# EAGLE design teensy_3-6sch (EAGLE 7.7.0)

## Sheet 1 of 3
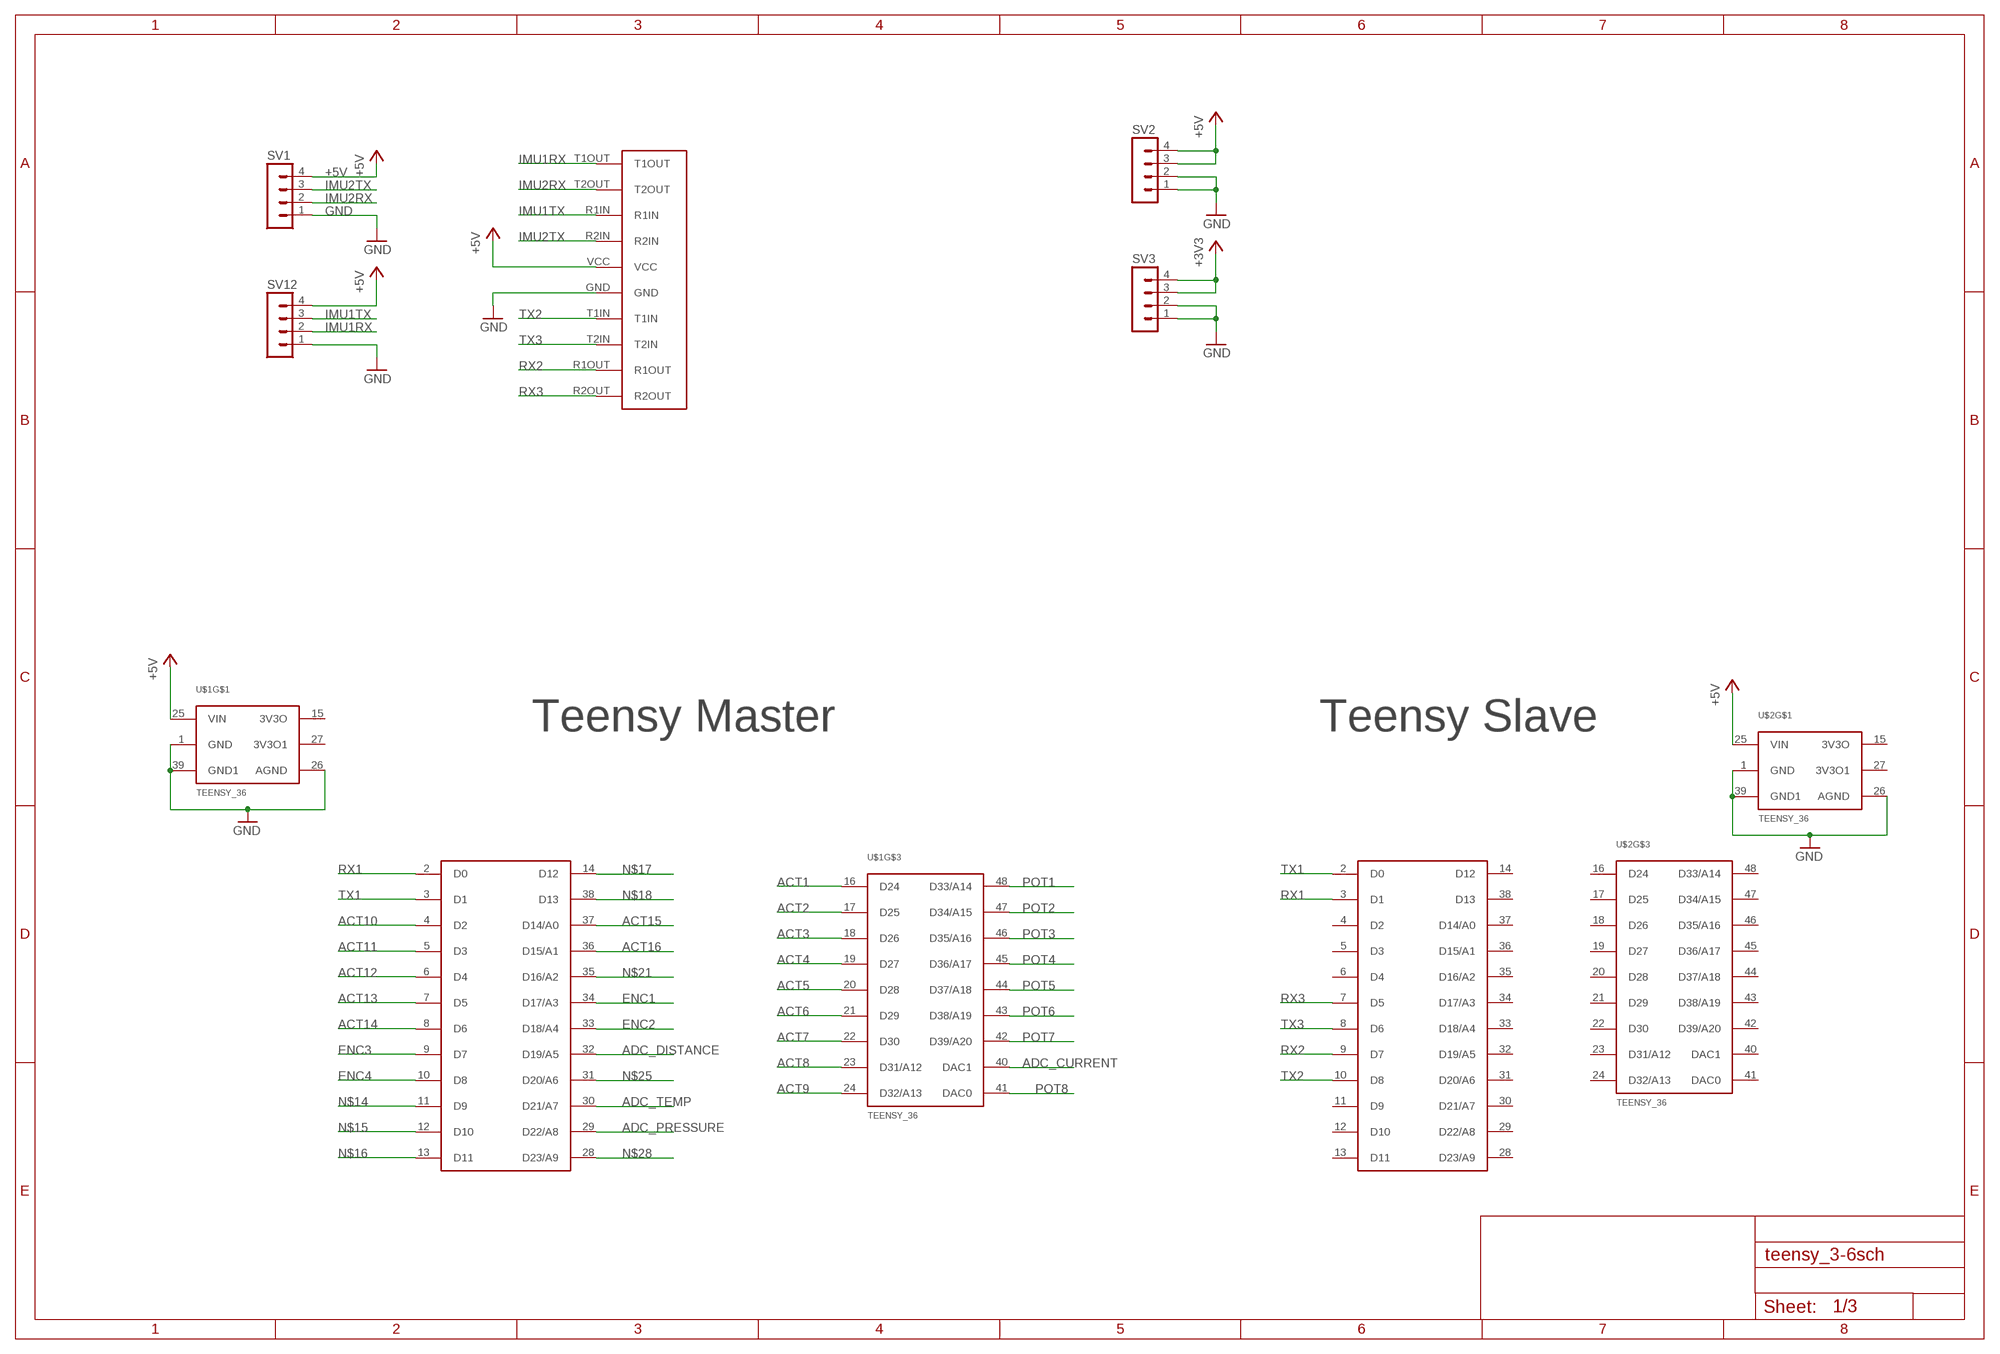
[diagram p0: schematic, sheet 1]

### Parts
SV1  MA04-1  [MA04-1]
SV2  MA04-1  [MA04-1]
SV3  MA04-1  [MA04-1]
SV12  MA04-1  [MA04-1]
U$1  TEENSY_36  [TEENSY36]
U$2  TEENSY_36  [TEENSY36]
U$3  MAX232_BREAKOUT  [MAX232_BREAKOUT]

### Nets
+3V3: SV3.3 SV3.4 ; also sheet 2,3
+5V: SV1.4 SV2.3 SV2.4 SV12.4 U$1.25(VIN) U$2.25(VIN) U$3.VCC ; also sheet 3
ACT1: U$1.16(D24) ; also sheet 2
ACT2: U$1.17(D25) ; also sheet 2
ACT3: U$1.18(D26) ; also sheet 2
ACT4: U$1.19(D27) ; also sheet 2
ACT5: U$1.20(D28) ; also sheet 2
ACT6: U$1.21(D29) ; also sheet 2
ACT7: U$1.22(D30) ; also sheet 2
ACT8: U$1.23(D31/A12) ; also sheet 2
ACT9: U$1.24(D32/A13) ; also sheet 2
ACT10: U$1.4(D2) ; also sheet 2
ACT11: U$1.5(D3) ; also sheet 2
ACT12: U$1.6(D4) ; also sheet 2
ACT13: U$1.7(D5) ; also sheet 2
ACT14: U$1.8(D6) ; also sheet 2
ACT15: U$1.37(D14/A0) ; also sheet 2
ACT16: U$1.36(D15/A1) ; also sheet 2
ADC_CURRENT: U$1.40(DAC1) ; also sheet 3
ADC_DISTANCE: U$1.32(D19/A5) ; also sheet 3
ADC_PRESSURE: U$1.29(D22/A8) ; also sheet 3
ADC_TEMP: U$1.30(D21/A7) ; also sheet 3
ENC1: U$1.34(D17/A3) ; also sheet 3
ENC2: U$1.33(D18/A4) ; also sheet 3
ENC3: U$1.9(D7) ; also sheet 3
ENC4: U$1.10(D8) ; also sheet 3
GND: SV1.1 SV2.1 SV2.2 SV3.1 SV3.2 SV12.1 U$1.1(GND) U$1.26(AGND) U$1.39(GND1) U$2.1(GND) U$2.26(AGND) U$2.39(GND1) U$3.GND ; also sheet 2,3
IMU1RX: SV12.2 U$3.T1OUT
IMU1TX: SV12.3 U$3.R1IN
IMU2RX: SV1.2 U$3.T2OUT
IMU2TX: SV1.3 U$3.R2IN
N$14: U$1.11(D9)
N$15: U$1.12(D10)
N$16: U$1.13(D11)
N$17: U$1.14(D12)
N$18: U$1.38(D13)
N$21: U$1.35(D16/A2)
N$25: U$1.31(D20/A6)
N$28: U$1.28(D23/A9)
POT1: U$1.48(D33/A14) ; also sheet 2
POT2: U$1.47(D34/A15) ; also sheet 2
POT3: U$1.46(D35/A16) ; also sheet 2
POT4: U$1.45(D36/A17) ; also sheet 2
POT5: U$1.44(D37/A18) ; also sheet 2
POT6: U$1.43(D38/A19) ; also sheet 2
POT7: U$1.42(D39/A20) ; also sheet 2
POT8: U$1.41(DAC0) ; also sheet 2
RX1: U$1.2(D0) U$2.3(D1)
RX2: U$2.9(D7) U$3.R1OUT
RX3: U$2.7(D5) U$3.R2OUT
TX1: U$1.3(D1) U$2.2(D0)
TX2: U$2.10(D8) U$3.T1IN
TX3: U$2.8(D6) U$3.T2IN
Unconnected: U$1.15(3V3O) U$1.27(3V3O1) U$2.4(D2) U$2.5(D3) U$2.6(D4) U$2.11(D9) U$2.12(D10) U$2.13(D11) U$2.14(D12) U$2.15(3V3O) U$2.16(D24) U$2.17(D25) U$2.18(D26) U$2.19(D27) U$2.20(D28) U$2.21(D29) U$2.22(D30) U$2.23(D31/A12) U$2.24(D32/A13) U$2.27(3V3O1) U$2.28(D23/A9) U$2.29(D22/A8) U$2.30(D21/A7) U$2.31(D20/A6) U$2.32(D19/A5) U$2.33(D18/A4) U$2.34(D17/A3) U$2.35(D16/A2) U$2.36(D15/A1) U$2.37(D14/A0) U$2.38(D13) U$2.40(DAC1) U$2.41(DAC0) U$2.42(D39/A20) U$2.43(D38/A19) U$2.44(D37/A18) U$2.45(D36/A17) U$2.46(D35/A16) U$2.47(D34/A15) U$2.48(D33/A14)

### Notes on the sheet
- Teensy Master | Teensy Slave

## Sheet 2 of 3
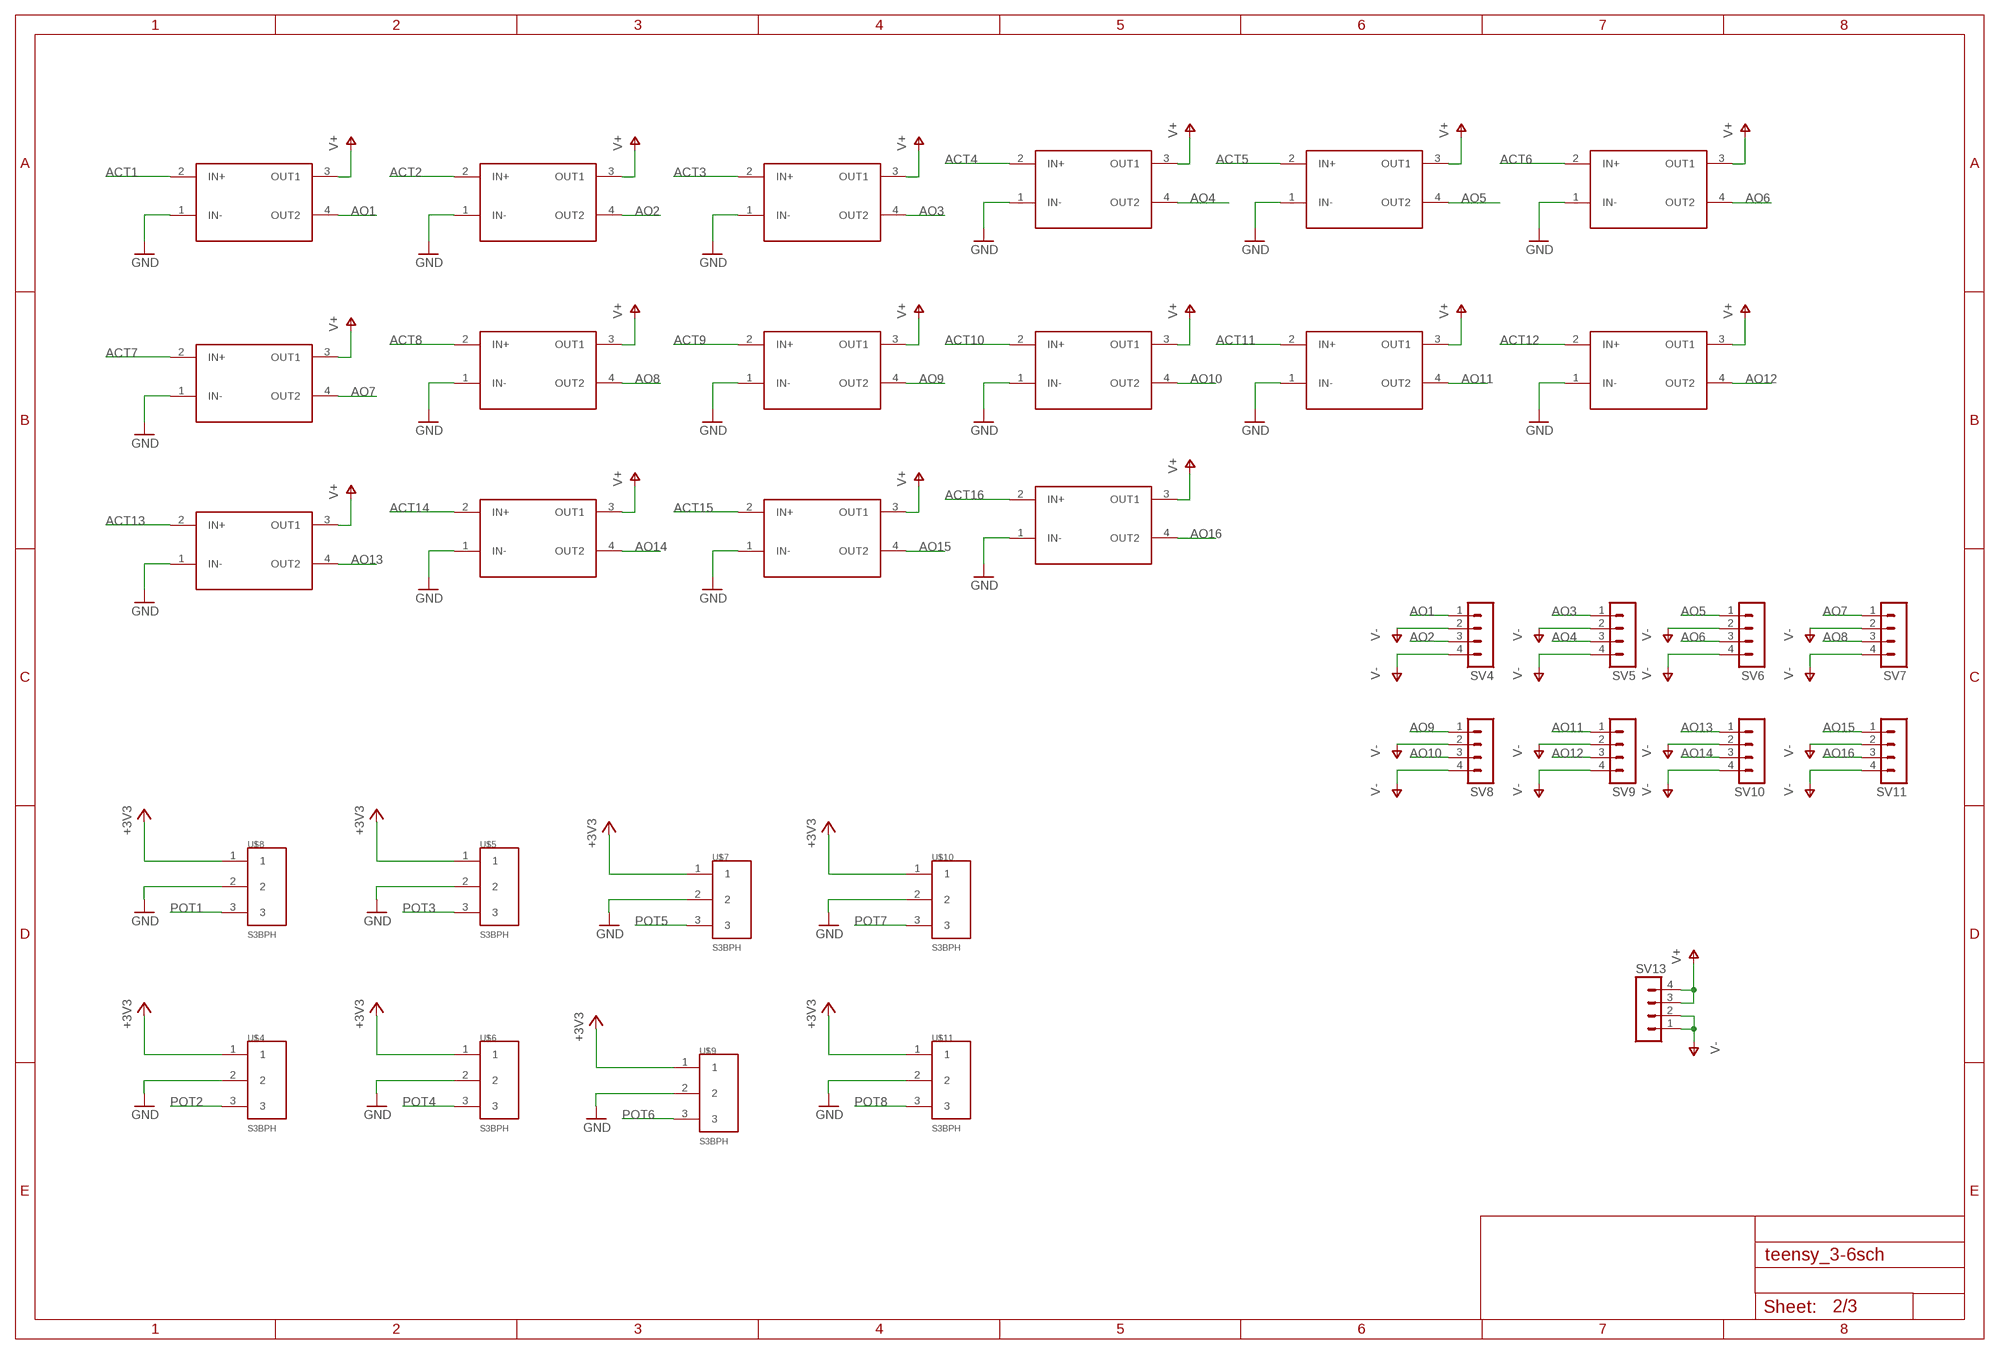
[diagram p1: schematic, sheet 2]

### Parts
SV4  MA04-1  [MA04-1]
SV5  MA04-1  [MA04-1]
SV6  MA04-1  [MA04-1]
SV7  MA04-1  [MA04-1]
SV8  MA04-1  [MA04-1]
SV9  MA04-1  [MA04-1]
SV10  MA04-1  [MA04-1]
SV11  MA04-1  [MA04-1]
SV13  MA04-1  [MA04-1]
U$4  S3BPH  [S3BPH]
U$5  S3BPH  [S3BPH]
U$6  S3BPH  [S3BPH]
U$7  S3BPH  [S3BPH]
U$8  S3BPH  [S3BPH]
U$9  S3BPH  [S3BPH]
U$10  S3BPH  [S3BPH]
U$11  S3BPH  [S3BPH]
U$12  CPC1706  [CPC1706]
U$13  CPC1706  [CPC1706]
U$14  CPC1706  [CPC1706]
U$15  CPC1706  [CPC1706]
U$16  CPC1706  [CPC1706]
U$17  CPC1706  [CPC1706]
U$18  CPC1706  [CPC1706]
U$19  CPC1706  [CPC1706]
U$20  CPC1706  [CPC1706]
U$21  CPC1706  [CPC1706]
U$22  CPC1706  [CPC1706]
U$23  CPC1706  [CPC1706]
U$24  CPC1706  [CPC1706]
U$25  CPC1706  [CPC1706]
U$26  CPC1706  [CPC1706]
U$27  CPC1706  [CPC1706]

### Nets
+3V3: U$4.1 U$5.1 U$6.1 U$7.1 U$8.1 U$9.1 U$10.1 U$11.1 ; also sheet 1,3
ACT1: U$12.2(IN+) ; also sheet 1
ACT2: U$13.2(IN+) ; also sheet 1
ACT3: U$14.2(IN+) ; also sheet 1
ACT4: U$15.2(IN+) ; also sheet 1
ACT5: U$16.2(IN+) ; also sheet 1
ACT6: U$17.2(IN+) ; also sheet 1
ACT7: U$18.2(IN+) ; also sheet 1
ACT8: U$19.2(IN+) ; also sheet 1
ACT9: U$20.2(IN+) ; also sheet 1
ACT10: U$21.2(IN+) ; also sheet 1
ACT11: U$22.2(IN+) ; also sheet 1
ACT12: U$23.2(IN+) ; also sheet 1
ACT13: U$24.2(IN+) ; also sheet 1
ACT14: U$25.2(IN+) ; also sheet 1
ACT15: U$26.2(IN+) ; also sheet 1
ACT16: U$27.2(IN+) ; also sheet 1
AO1: SV4.1 U$12.4(OUT2)
AO2: SV4.3 U$13.4(OUT2)
AO3: SV5.1 U$14.4(OUT2)
AO4: SV5.3 U$15.4(OUT2)
AO5: SV6.1 U$16.4(OUT2)
AO6: SV6.3 U$17.4(OUT2)
AO7: SV7.1 U$18.4(OUT2)
AO8: SV7.3 U$19.4(OUT2)
AO9: SV8.1 U$20.4(OUT2)
AO10: SV8.3 U$21.4(OUT2)
AO11: SV9.1 U$22.4(OUT2)
AO12: SV9.3 U$23.4(OUT2)
AO13: SV10.1 U$24.4(OUT2)
AO14: SV10.3 U$25.4(OUT2)
AO15: SV11.1 U$26.4(OUT2)
AO16: SV11.3 U$27.4(OUT2)
GND: U$4.2 U$5.2 U$6.2 U$7.2 U$8.2 U$9.2 U$10.2 U$11.2 U$12.1(IN-) U$13.1(IN-) U$14.1(IN-) U$15.1(IN-) U$16.1(IN-) U$17.1(IN-) U$18.1(IN-) U$19.1(IN-) U$20.1(IN-) U$21.1(IN-) U$22.1(IN-) U$23.1(IN-) U$24.1(IN-) U$25.1(IN-) U$26.1(IN-) U$27.1(IN-) ; also sheet 1,3
POT1: U$8.3 ; also sheet 1
POT2: U$4.3 ; also sheet 1
POT3: U$5.3 ; also sheet 1
POT4: U$6.3 ; also sheet 1
POT5: U$7.3 ; also sheet 1
POT6: U$9.3 ; also sheet 1
POT7: U$10.3 ; also sheet 1
POT8: U$11.3 ; also sheet 1
V+: SV13.3 SV13.4 U$12.3(OUT1) U$13.3(OUT1) U$14.3(OUT1) U$15.3(OUT1) U$16.3(OUT1) U$17.3(OUT1) U$18.3(OUT1) U$19.3(OUT1) U$20.3(OUT1) U$21.3(OUT1) U$22.3(OUT1) U$23.3(OUT1) U$24.3(OUT1) U$25.3(OUT1) U$26.3(OUT1) U$27.3(OUT1)
V-: SV4.2 SV4.4 SV5.2 SV5.4 SV6.2 SV6.4 SV7.2 SV7.4 SV8.2 SV8.4 SV9.2 SV9.4 SV10.2 SV10.4 SV11.2 SV11.4 SV13.1 SV13.2

## Sheet 3 of 3
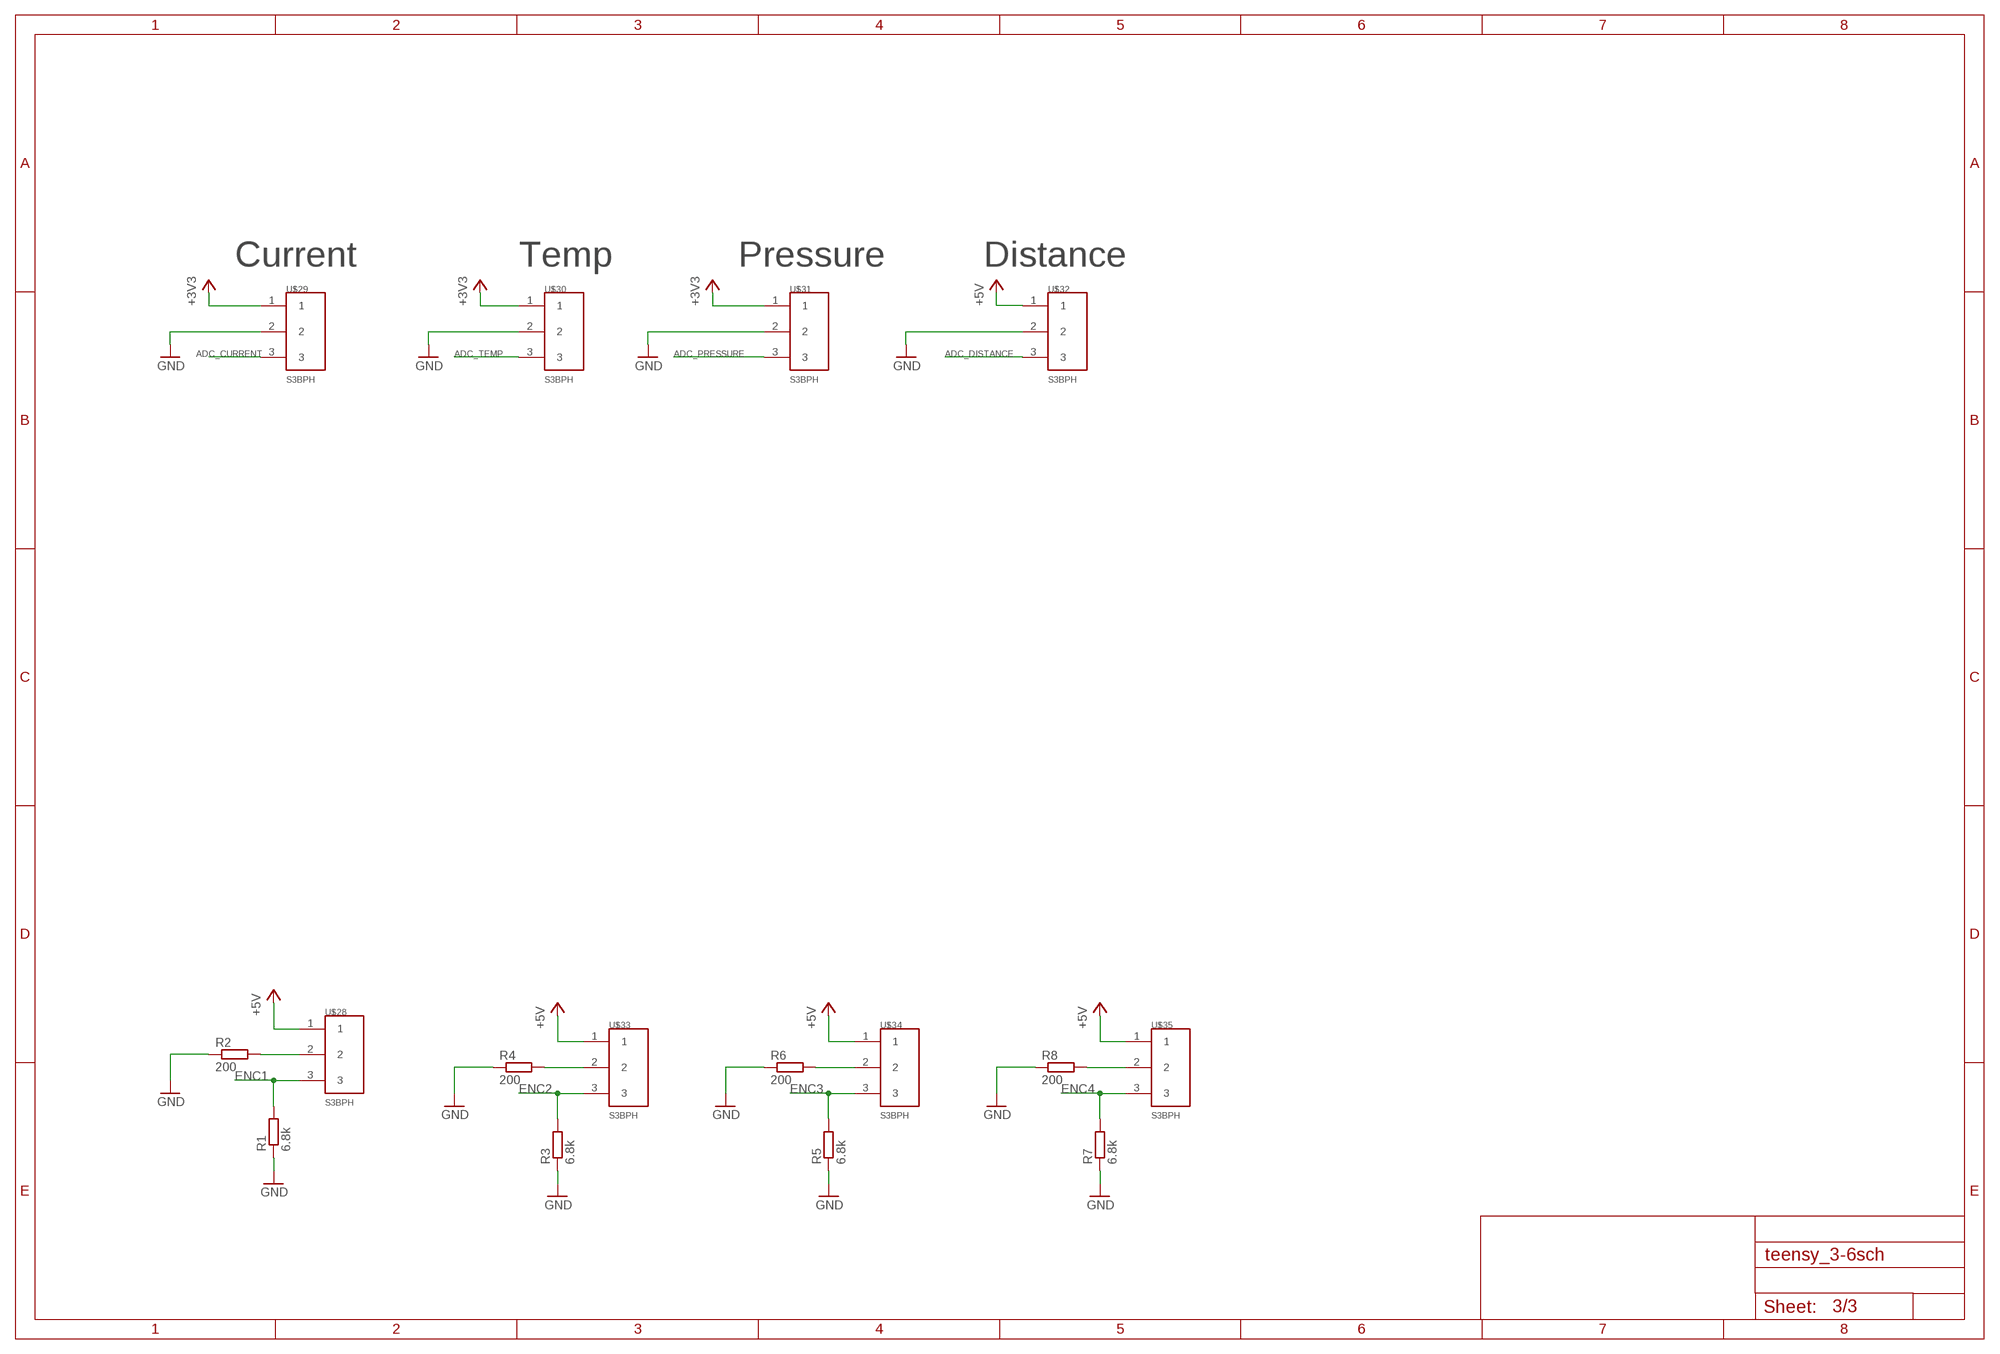
[diagram p2: schematic, sheet 3]

### Parts
R1  6.8k  R-EU_M0805  [M0805]
R2  200  R-EU_M0805  [M0805]
R3  6.8k  R-EU_M0805  [M0805]
R4  200  R-EU_M0805  [M0805]
R5  6.8k  R-EU_M0805  [M0805]
R6  200  R-EU_M0805  [M0805]
R7  6.8k  R-EU_M0805  [M0805]
R8  200  R-EU_M0805  [M0805]
U$28  S3BPH  [S3BPH]
U$29  S3BPH  [S3BPH]
U$30  S3BPH  [S3BPH]
U$31  S3BPH  [S3BPH]
U$32  S3BPH  [S3BPH]
U$33  S3BPH  [S3BPH]
U$34  S3BPH  [S3BPH]
U$35  S3BPH  [S3BPH]

### Nets
+3V3: U$29.1 U$30.1 U$31.1 ; also sheet 1,2
+5V: U$28.1 U$32.1 U$33.1 U$34.1 U$35.1 ; also sheet 1
ADC_CURRENT: U$29.3 ; also sheet 1
ADC_DISTANCE: U$32.3 ; also sheet 1
ADC_PRESSURE: U$31.3 ; also sheet 1
ADC_TEMP: U$30.3 ; also sheet 1
ENC1: R1.2 U$28.3 ; also sheet 1
ENC2: R3.2 U$33.3 ; also sheet 1
ENC3: R5.2 U$34.3 ; also sheet 1
ENC4: R7.2 U$35.3 ; also sheet 1
GND: R1.1 R2.1 R3.1 R4.1 R5.1 R6.1 R7.1 R8.1 U$29.2 U$30.2 U$31.2 U$32.2 ; also sheet 1,2
N$1: R2.2 U$28.2
N$2: R4.2 U$33.2
N$3: R6.2 U$34.2
N$4: R8.2 U$35.2

### Notes on the sheet
- Current | Temp | Pressure | Distance

## Library data of the parts
R1-R8 = rcl:R-EU_: RESISTOR, European symbol
SV1-SV13 = con-lstb:MA04-1: PIN HEADER; OC_FARNELL: unknown; OC_NEWARK: unknown
U$1 U$2 = misc_luke:TEENSY_36
U$3 = misc_luke:MAX232_BREAKOUT
U$4-U$11 U$28-U$35 = misc_luke:S3BPH
U$12-U$27 = misc_luke:CPC1706

## Board
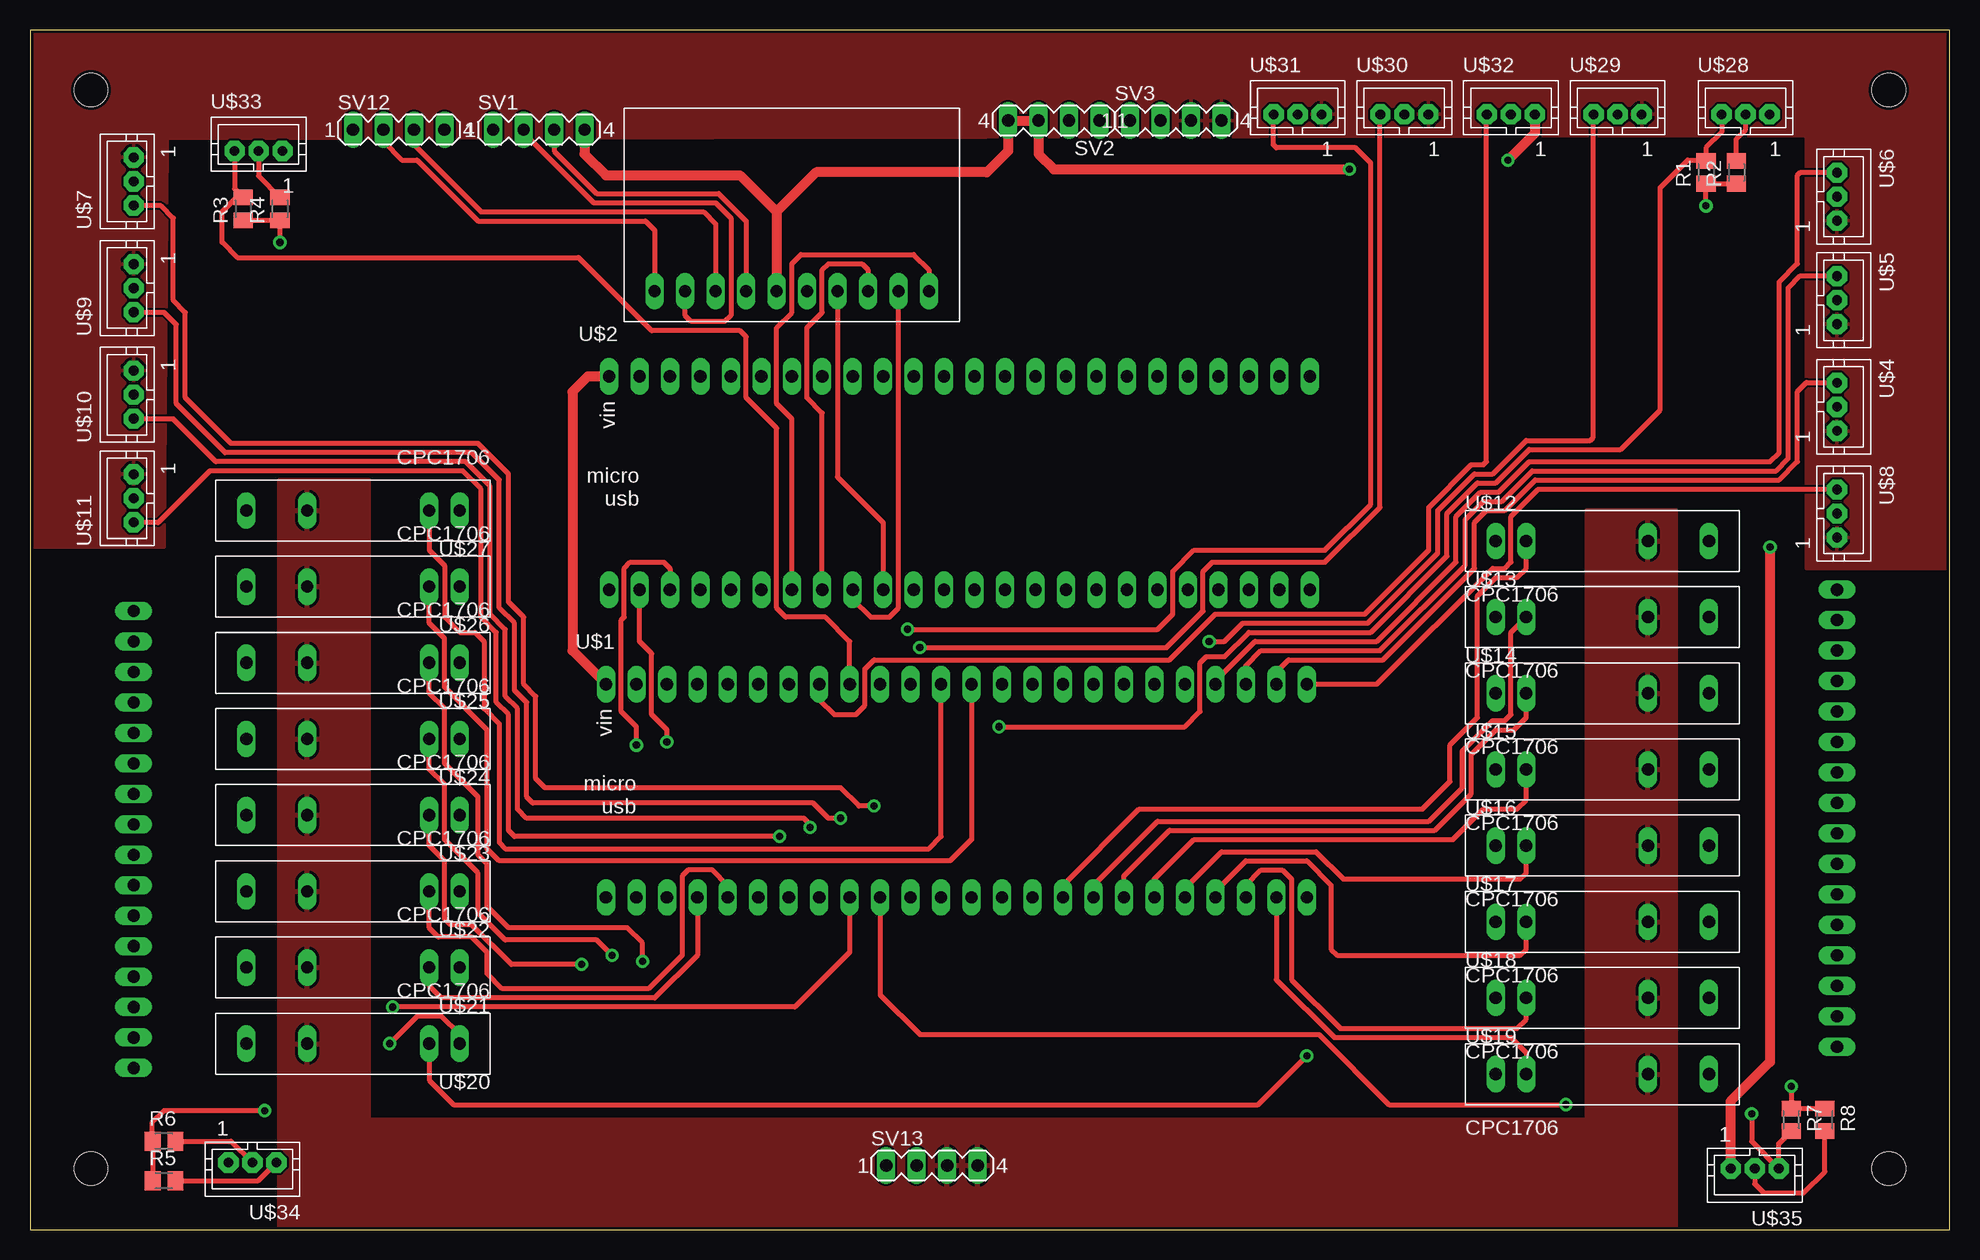
[diagram p3: board, top side]
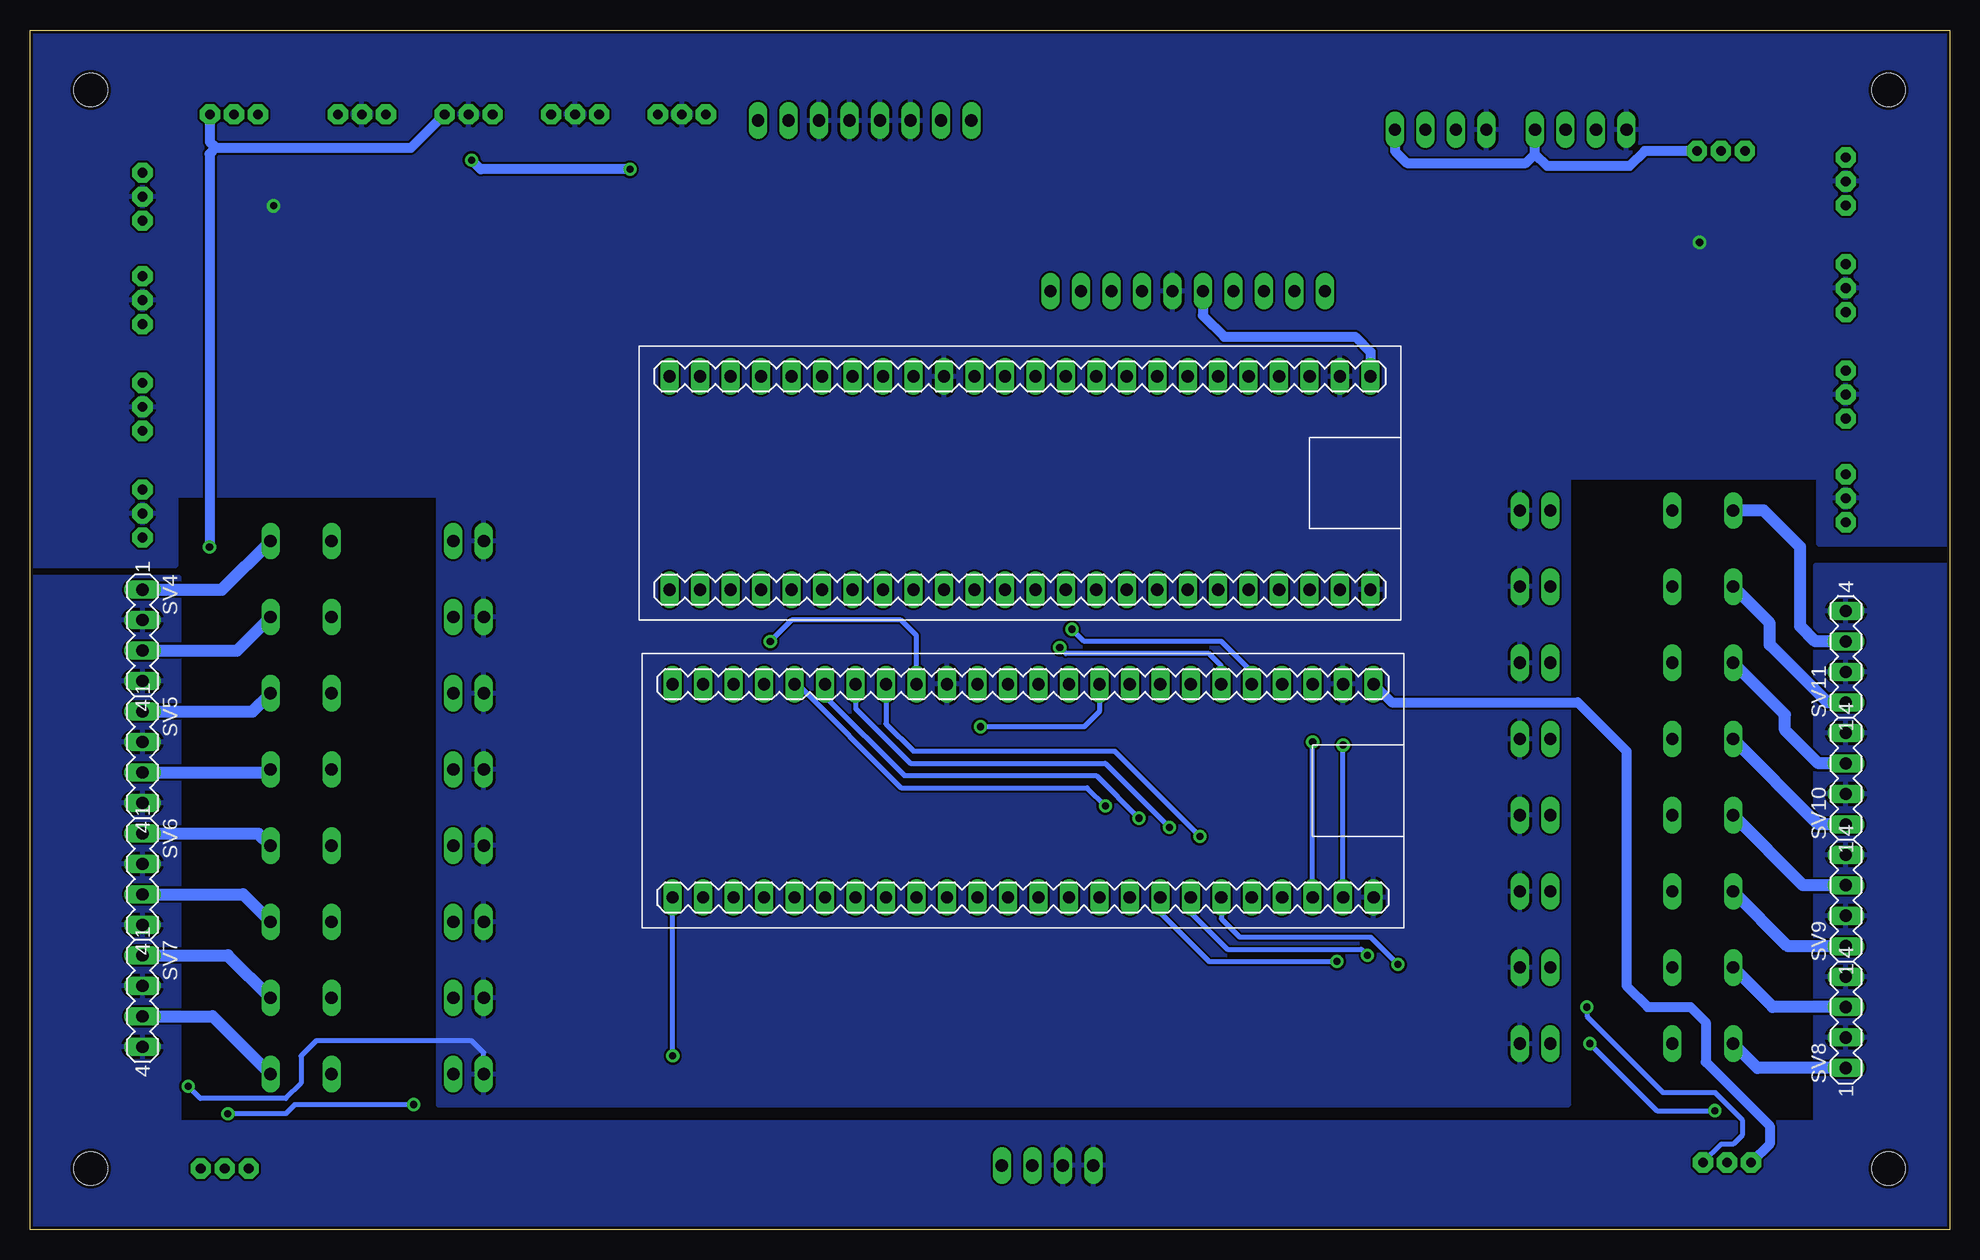
[diagram p4: board, bottom side, seen from below]

Size 160 x 100 mm. Coordinates in mm from the lower left corner, seen from the top.
Outline: 0,0 160,0 160,100 0,100 0,0
Copper layers (1*16): Top 0.035mm / dielectric 1.5mm / Bottom 0.035mm
Design rules "GoldPhoenix": minimum track width 7mil, minimum drill 10mil, track to track 7mil, track to pad 7mil, pad to pad 7mil, via to via 7mil, smd to smd 7mil, copper to edge 10mil, drill to drill 8mil, minimum pad ring 10mil, minimum via ring 10mil, stop-mask expansion 4mil, vias tented up to drill 25mil, thermal gap 10mil
Holes 2.8 mm at 5.08,5.08 5.08,95 154.94,95 154.94,5.08

### Footprints (pad centres in the part's own frame; a part is rotated, then mirrored left to right if it is on the bottom)
M0805 = smd 1.3 x 1.6: 1 -0.95,0; 2 0.95,0
MA04-1 = drill 1.016 long: 1 -3.81,0; 2 -1.27,0; 3 1.27,0; 4 3.81,0
TEENSY36 = drill 1.016 long: 1 -25.4,-8.89; 2 -22.86,-8.89; 3 -20.32,-8.89; 4 -17.78,-8.89; 5 -15.24,-8.89; 6 -12.7,-8.89; 7 -10.16,-8.89; 8 -7.62,-8.89; 9 -5.08,-8.89; 10 -2.54,-8.89; 11 0,-8.89; 12 2.54,-8.89; 13 5.08,-8.89; 14 7.62,-8.89; 15 10.16,-8.89; 16 12.7,-8.89; 17 15.24,-8.89; 18 17.78,-8.89; 19 20.32,-8.89; 20 22.86,-8.89; 21 25.4,-8.89; 22 27.94,-8.89; 23 30.48,-8.89; 24 33.02,-8.89; 25 -25.4,8.89; 26 -22.86,8.89; 27 -20.32,8.89; 28 -17.78,8.89; 29 -15.24,8.89; 30 -12.7,8.89; 31 -10.16,8.89; 32 -7.62,8.89; 33 -5.08,8.89; 34 -2.54,8.89; 35 0,8.89; 36 2.54,8.89; 37 5.08,8.89; 38 7.62,8.89; 39 10.16,8.89; 40 12.7,8.89; 41 15.24,8.89; 42 17.78,8.89; 43 20.32,8.89; 44 22.86,8.89; 45 25.4,8.89; 46 27.94,8.89; 47 30.48,8.89; 48 33.02,8.89
MAX232_BREAKOUT = drill 1.016 long: GND 12.7,0; R1IN 5.08,0; R1OUT 20.32,0; R2IN 7.62,0; R2OUT 22.86,0; T1IN 15.24,0; T1OUT 0,0; T2IN 17.78,0; T2OUT 2.54,0; VCC 10.16,0
S3BPH = drill 0.813 pad 1.676 octagon: 1 2,0; 2 0,0; 3 -2,0
CPC1706 = drill 1.016 long: 1 -7.62,0; 2 -5.08,0; 3 5.08,0; 4 10.16,0

### Placement (x,y rotation side)
R1  139.7,88.14 90 top
R2  142.24,88.14 90 top
R3  17.78,85.09 90 top
R4  20.83,85.09 90 top
R5  11.18,4.06 0 top
R6  11.18,7.37 0 top
R7  146.81,9.14 270 top
R8  149.61,9.14 270 top
SV1  42.42,91.69 0 top
SV2  85.34,92.46 180 top
SV3  95.5,92.46 0 top
SV4  150.62,49.53 270 bottom
SV5  150.62,39.37 270 bottom
SV6  150.62,29.21 270 bottom
SV7  150.62,19.05 270 bottom
SV8  8.64,17.27 90 bottom
SV9  8.64,27.43 90 bottom
SV10  8.64,37.59 90 bottom
SV11  8.64,47.75 90 bottom
SV12  30.73,91.69 0 top
SV13  75.18,5.33 0 top
U$1  73.41,36.58 0 top
U$2  73.66,62.23 0 top
U$3  52.07,78.23 0 top
U$4  150.62,68.58 270 top
U$5  150.62,77.47 270 top
U$6  150.62,86.11 270 top
U$7  8.64,87.38 90 top
U$8  150.62,59.69 270 top
U$9  8.64,78.49 90 top
U$10  8.64,69.6 90 top
U$11  8.64,60.96 90 top
U$12  129.79,57.4 0 top
U$13  129.79,51.05 0 top
U$14  129.79,44.7 0 top
U$15  129.79,38.35 0 top
U$16  129.79,32 0 top
U$17  129.79,25.65 0 top
U$18  129.79,19.3 0 top
U$19  129.79,12.95 0 top
U$20  28.19,15.49 180 top
U$21  28.19,21.84 180 top
U$22  28.19,28.19 180 top
U$23  28.19,34.54 180 top
U$24  28.19,40.89 180 top
U$25  28.19,47.24 180 top
U$26  28.19,53.59 180 top
U$27  28.19,59.94 180 top
U$28  143,92.96 0 top
U$29  132.33,92.96 0 top
U$30  114.55,92.96 0 top
U$31  105.66,92.96 0 top
U$32  123.44,92.96 0 top
U$33  19.05,89.92 0 top
U$34  18.54,5.59 180 top
U$35  143.76,5.08 180 top

### Tracks (layer width: path | path; a pad name or v marks a point on that pad's centre or on a via)
+3V3
  pour Top (rank 2): 0,100.08 160.02,100.08 160.02,55.12 148.08,55.12 148.08,91.19 11.43,90.93 11.18,56.9 0,56.9
+5V  (via drill 0.6)
  Top 0.813: v109.98,88.39 85.34,88.39 84.07,89.66 SV2.3 SV2.4 81.53,89.92 79.76,88.14 65.53,88.14 62.23,84.84 | v123.19,89.15 125.48,91.44 125.48,92.93 U$32.1 | v145.03,56.9 145.03,13.97 141.73,10.67 141.73,5.11 U$35.1 | 62.23,84.84 U$3.VCC | SV1.4 46.23,89.66 48.01,87.88 59.18,87.88 62.23,84.84 | U$2.25 46.48,71.12 45.21,69.85 45.21,48.26 U$1.25
  Bottom 0.813: U$28.1 145,90.65 144.53,90.17 | 144.53,90.17 128.24,90.17 U$32.1 | v109.98,88.39 122.43,88.39 v123.19,89.15 | 144.53,90.17 145.03,89.66 v145.03,56.9 | U$1.25 46.48,43.94 30.99,43.94 26.92,39.88 26.92,20.32 25.15,18.54 21.59,18.54 20.32,17.27 20.32,13.97 14.99,8.64 14.99,7.11 16.51,5.59 U$34.1 | SV1.4 46.23,89.92 45.21,88.9 35.31,88.9 34.54,89.66 | 34.54,89.66 SV12.4 | U$33.1 25.4,89.92 26.67,88.65 33.53,88.65 34.54,89.66 | U$3.VCC 62.23,76.2 60.45,74.42 49.53,74.42 48.26,73.15 U$2.25
ACT1
  Top 0.406: U$1.16 86.11,28.7 92.46,35.05 116.08,35.05 118.36,37.34 118.36,40.39 120.65,42.67 120.65,52.83 122.17,54.36 123.95,54.36 124.71,55.12 U$12.2
ACT2
  Top 0.406: U$1.17 88.65,28.7 93.98,34.04 116.59,34.04 119.38,36.83 119.38,39.88 121.92,42.42 122.94,42.42 123.44,42.93 123.44,49.78 U$13.2
ACT3
  Top 0.406: U$1.18 91.19,29.46 95,33.27 117.09,33.27 120.14,36.32 120.14,39.62 122.17,41.66 123.7,41.66 124.71,42.67 U$14.2
ACT4
  Top 0.406: U$1.19 93.73,29.21 97.03,32.51 118.62,32.51 121.16,35.05 123.95,35.05 124.71,35.81 U$15.2
ACT5
  Top 0.406: U$1.20 96.27,28.45 99.31,31.5 107.19,31.5 109.47,29.21 124.21,29.21 124.71,29.72 U$16.2
ACT6
  Top 0.406: U$1.21 98.81,28.19 101.35,30.73 106.43,30.73 108.46,28.7 108.46,23.37 108.97,22.86 124.21,22.86 124.71,23.37 U$17.2
ACT7
  Top 0.406: U$1.22 101.35,28.7 102.62,29.97 104.39,29.97 105.16,29.21 105.16,20.83 109.22,16.76 123.95,16.76 124.71,17.53 U$18.2
ACT8
  Top 0.406: U$1.23 103.89,20.83 108.71,16 123.44,16 124.71,14.73 U$19.2
ACT9  (via drill 0.6)
  Top 0.406: U$20.2 33.27,12.45 35.31,10.41 102.36,10.41 v106.43,14.48
  Bottom 0.406: v106.43,14.48 U$1.24
ACT10
  Top 0.406: U$1.4 55.63,22.86 52.07,19.3 34.29,19.3 33.27,20.32 U$21.2
ACT11
  Top 0.406: U$1.5 58.17,28.7 56.9,29.97 54.86,29.97 54.36,29.46 54.36,22.86 51.56,20.07 39.37,20.07 38.1,21.34 38.1,23.11 36.83,24.38 34.04,24.38 33.27,25.15 U$22.2
ACT12  (via drill 0.6)
  Top 0.406: v45.97,22.1 40.13,22.1 36.83,25.4 35.05,25.4 34.54,25.91 34.54,30.73 33.27,32 U$23.2
  Bottom 0.406: U$1.6 60.71,25.91 59.18,24.38 48.26,24.38 v45.97,22.1
ACT13  (via drill 0.6)
  Top 0.406: v48.51,22.86 47.24,24.13 39.62,24.13 37.34,26.42 37.34,29.72 34.54,32.51 34.54,37.08 33.27,38.35 U$24.2
  Bottom 0.406: U$1.7 63.25,26.42 60.2,23.37 49.02,23.37 v48.51,22.86
ACT14  (via drill 0.6)
  Top 0.406: v51.05,22.35 51.05,23.88 49.78,25.15 39.88,25.15 38.1,26.92 38.1,30.48 37.34,31.24 37.34,36.07 34.54,38.86 34.54,43.43 33.27,44.7 U$25.2
  Bottom 0.406: U$1.8 65.79,26.42 61.72,22.35 v51.05,22.35
ACT15
  Top 0.406: U$1.37 78.49,32.51 76.71,30.73 39.12,30.73 38.1,31.75 38.1,41.66 34.54,45.21 34.54,49.28 33.27,50.55 U$26.2
ACT16
  Top 0.406: U$27.2 33.27,56.64 34.54,55.37 34.54,51.05 35.81,49.78 37.08,49.78 37.85,49.02 37.85,43.43 39.12,42.16 39.12,32.26 39.62,31.75 74.93,31.75 75.95,32.77 U$1.36
ADC_CURRENT  (via drill 0.6)
  Top 0.406: v98.3,49.02 99.57,49.02 101.09,50.55 111.51,50.55 117.35,56.39 117.35,59.94 120.4,62.99 121.92,62.99 124.71,65.79 130.05,65.79 130.3,66.04 130.3,92.93 U$29.3
  Bottom 0.406: U$1.40 86.11,49.53 87.38,50.8 96.52,50.8 v98.3,49.02
ADC_DISTANCE
  Top 0.406: U$1.32 65.79,44.2 67.06,42.93 68.83,42.93 69.6,43.69 69.6,46.74 70.36,47.5 95,47.5 98.81,51.31 111.25,51.31 116.59,56.64 116.59,60.2 120.14,63.75 121.16,63.75 121.41,64.01 121.41,92.93 U$32.3
ADC_PRESSURE  (via drill 0.6)
  Top 0.406: v73.15,50.04 93.98,50.04 95.25,51.31 95.25,54.86 97.03,56.64 107.95,56.64 111.76,60.45 111.76,88.9 110.49,90.17 103.89,90.17 103.63,90.42 103.63,92.93 U$31.3
  Bottom 0.406: U$1.29 58.17,46.48 60.71,49.02 72.14,49.02 v73.15,50.04
ADC_TEMP  (via drill 0.6)
  Top 0.406: v74.17,48.51 94.74,48.51 97.79,51.56 97.79,54.86 98.55,55.63 107.95,55.63 112.52,60.2 112.52,92.93 U$30.3
  Bottom 0.406: U$1.30 60.71,46.99 61.72,48.01 73.66,48.01 v74.17,48.51
AO1
  Bottom 1.016: SV4.1 144.02,53.34 U$12.4
AO2
  Bottom 1.016: SV4.3 142.75,48.26 U$13.4
AO3
  Bottom 1.016: SV5.1 141.48,43.18 U$14.4
AO4
  Bottom 1.016: SV5.3 140.21,38.1 U$15.4
AO5
  Bottom 1.016: SV6.1 140.97,33.02 U$16.4
AO6
  Bottom 1.016: SV6.3 142.24,27.94 U$17.4
AO7
  Bottom 1.016: SV7.1 143.51,22.86 U$18.4
AO8
  Bottom 1.016: SV7.3 144.78,17.78 U$19.4
AO9
  Bottom 1.016: SV8.1 16,13.46 U$20.4
AO10
  Bottom 1.016: SV8.3 14.73,18.54 U$21.4
AO11
  Bottom 1.016: SV9.1 13.46,23.62 U$22.4
AO12
  Bottom 1.016: SV9.3 12.19,28.7 U$23.4
AO13
  Bottom 1.016: SV10.1 10.92,33.78 U$24.4
AO14
  Bottom 1.016: SV10.3 10.92,38.86 13.72,41.66 13.72,42.93 U$25.4
AO15
  Bottom 1.016: SV11.1 10.16,43.94 14.99,48.77 14.99,50.55 U$26.4
AO16
  Bottom 1.016: SV11.3 11.18,49.02 12.45,50.29 12.45,56.9 15.49,59.94 U$27.4
ENC1  (via drill 0.6)
  Top 0.406: v80.77,41.91 96.27,41.91 97.54,43.18 97.54,47.24 98.04,47.75 99.57,47.75 101.6,49.78 111.76,49.78 118.11,56.13 118.11,59.69 120.65,62.23 122.17,62.23 124.97,65.02 132.59,65.02 135.89,68.33 135.89,86.87 138.18,89.15 139.63,89.15 R1.2 139.7,90.17 141,91.47 U$28.3
  Bottom 0.406: U$1.34 70.87,43.18 72.14,41.91 v80.77,41.91
ENC2
  Top 0.406: U$33.3 17.05,86.77 R3.2 17.21,86.04 16,84.84 16,82.3 17.27,81.03 45.72,81.03 51.82,74.93 59.18,74.93 59.69,74.42 59.69,69.34 62.23,66.8 62.23,51.82 62.99,51.05 66.29,51.05 68.33,49.02 U$1.33
ENC3  (via drill 0.6)
  Top 0.406: R5.2 19.02,4.06 U$34.3 | U$1.9 68.33,23.11 63.75,18.54 v30.23,18.54
  Bottom 0.406: v30.23,18.54 30.23,17.78 23.88,11.43 19.56,11.43 17.27,9.14 17.27,7.87 18.03,7.11 19.02,7.11 U$34.3 20.57,5.62
ENC4  (via drill 0.6)
  Top 0.406: U$1.10 70.87,19.56 74.17,16.26 107.44,16.26 113.28,10.41 v128.02,10.41 | v143.51,9.65 143.51,7.33 U$35.3 145.76,7.15 R7.2
  Bottom 0.406: v128.02,10.41 137.92,10.41 138.68,9.65 v143.51,9.65
GND  (via drill 0.6)
  Top 0.406: R3.1 R4.1 v20.83,82.3 | U$20.1 35.81,16.26 34.29,17.78 32.26,17.78 v29.97,15.49 | v19.56,9.91 11.18,9.91 10.16,8.89 10.16,7.43 R6.1 R5.1 | v146.81,11.94 R7.1 R8.1 | R2.1 R1.1 v139.7,85.34
  Bottom 0.406: v29.97,15.49 24.38,9.91 v19.56,9.91 | U$19.1 122.17,14.73 123.19,15.75 136.14,15.75 137.41,14.48 137.41,12.19 138.68,10.92 145.8,10.92 v146.81,11.94
  pour Bottom (rank 6): 0,100.08 160.02,100.08 160.02,55.37 147.83,55.37 147.83,61.21 125.98,61.21 125.98,10.41 31.75,10.41 31.75,62.74 10.92,62.74 10.92,57.15 0,57.15
IMU1RX
  Top 0.406: SV12.2 29.46,90.68 30.99,89.15 32.26,89.15 37.34,84.07 51.31,84.07 52.07,83.31 U$3.T1OUT
IMU1TX
  Top 0.406: SV12.3 32,90.42 37.59,84.84 56.13,84.84 57.15,83.82 U$3.R1IN
IMU2RX
  Top 0.406: SV1.2 41.15,91.44 46.99,85.6 57.15,85.6 58.42,84.33 58.42,76.2 57.91,75.69 55.12,75.69 54.61,76.2 U$3.T2OUT
IMU2TX
  Top 0.406: SV1.3 43.69,89.92 47.24,86.36 57.4,86.36 59.69,84.07 U$3.R2IN
N$1
  Top 0.406: R2.2 142.24,90.93 143,91.69 U$28.2
N$2
  Top 0.406: U$33.2 19.05,87.82 R4.2
N$3
  Top 0.406: R6.2 16.76,7.37 U$34.2
N$4
  Top 0.406: U$35.2 143.76,3.81 144.53,3.05 147.83,3.05 149.61,4.83 R8.2
POT1
  Top 0.406: U$1.48 112.27,45.47 121.92,55.12 122.94,55.12 123.44,55.63 123.44,59.44 125.7,61.69 U$8.3
POT2
  Top 0.406: U$1.47 103.89,46.48 104.9,47.5 112.78,47.5 120.4,55.12 120.4,58.93 121.41,59.94 122.94,59.94 125.48,62.48 145.8,62.48 147.32,64.01 147.32,69.85 148.08,70.61 150.59,70.61 U$4.3
POT3
  Top 0.406: U$1.46 101.35,46.99 102.62,48.26 112.52,48.26 119.63,55.37 119.63,59.18 121.16,60.71 122.68,60.71 125.22,63.25 145.54,63.25 146.56,64.26 146.56,78.49 147.57,79.5 150.59,79.5 U$5.3
POT4
  Top 0.406: U$1.45 98.81,45.72 102.11,49.02 112.27,49.02 118.87,55.63 118.87,59.44 120.9,61.47 122.43,61.47 124.97,64.01 145.03,64.01 145.8,64.77 145.8,78.99 147.32,80.52 147.32,87.88 147.57,88.14 150.59,88.14 U$6.3
POT5  (via drill 0.6)
  Top 0.406: v70.36,35.31 69.09,35.31 67.56,36.83 42.93,36.83 42.16,37.59 42.16,44.45 41.15,45.47 41.15,51.05 39.88,52.32 39.88,62.99 37.34,65.53 16.76,65.53 12.95,69.34 12.95,76.45 11.94,77.47 11.94,84.33 10.92,85.34 8.67,85.34 U$7.3
  Bottom 0.406: 96.27,44.45 U$1.44 96.01,45.47 87.38,36.83 71.88,36.83 v70.36,35.31
POT6  (via drill 0.6)
  Top 0.406: v67.56,34.29 66.55,34.29 65.28,35.56 41.91,35.56 41.4,36.07 41.4,43.94 40.39,44.96 40.39,50.55 39.12,51.82 39.12,62.48 36.83,64.77 16.26,64.77 12.19,68.83 12.19,75.44 11.18,76.45 8.67,76.45 U$9.3
  Bottom 0.406: U$1.43 93.73,44.45 87.12,37.85 71.12,37.85 v67.56,34.29
POT7  (via drill 0.6)
  Top 0.406: v65.02,33.53 65.02,33.78 64.52,34.29 41.4,34.29 40.64,35.05 40.64,43.43 39.62,44.45 39.62,50.04 38.35,51.31 38.35,61.98 36.32,64.01 15.49,64.01 11.94,67.56 8.67,67.56 U$10.3
  Bottom 0.406: U$1.42 91.19,43.43 86.61,38.86 70.36,38.86 v65.02,33.53
POT8  (via drill 0.6)
  Top 0.406: v62.48,32.77 40.39,32.77 39.88,33.27 39.88,42.93 38.86,43.94 38.86,49.78 37.59,51.05 37.59,61.72 36.07,63.25 14.99,63.25 10.67,58.93 8.67,58.93 U$11.3
  Bottom 0.406: U$1.41 88.65,42.16 86.36,39.88 69.6,39.88 v62.48,32.77
RX1  (via drill 0.6)
  Top 0.406: v50.55,40.39 50.55,41.91 49.28,43.18 49.28,50.8 49.53,51.05 49.53,55.12 50.04,55.63 52.83,55.63 53.34,55.12 U$2.3
  Bottom 0.406: U$1.2 v50.55,40.39
RX2
  Top 0.406: U$2.9 68.58,52.58 70.1,51.05 71.63,51.05 72.39,51.82 U$3.R1OUT
RX3
  Top 0.406: U$2.7 63.5,67.56 62.23,68.83 62.23,75.18 63.5,76.45 63.5,80.52 64.26,81.28 73.66,81.28 74.93,80.01 U$3.R2OUT
TX1  (via drill 0.6)
  Top 0.406: v53.09,40.64 53.09,41.66 51.82,42.93 51.82,48.01 50.8,49.02 U$2.2
  Bottom 0.406: U$1.3 v53.09,40.64
TX2
  Top 0.406: U$3.T1IN 67.31,62.74 71.12,58.93 U$2.10
TX3
  Top 0.406: U$2.8 66.04,68.07 64.77,69.34 64.77,75.18 66.04,76.45 66.04,80.01 66.55,80.52 69.34,80.52 69.85,80.01 U$3.T2IN
V+
  pour Top (rank 4): 20.83,62.48 28.19,62.48 28.19,9.14 129.79,9.14 129.79,59.94 137.16,59.94 137.16,0 20.83,0
V-
  pour Bottom (rank 3): 0,55.37 11.18,55.37 11.18,8.89 147.57,8.89 147.57,54.36 160.02,54.36 160.02,0 0,0